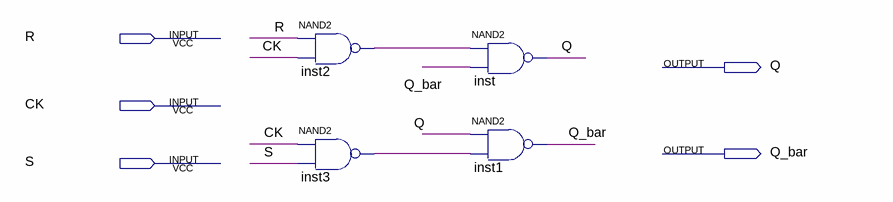
[diagram p0: schematic sheet]
// Quartus schematic RS_FF_NAND.bdf as structural Verilog: 4 symbols, 5 pins
module RS_FF_NAND (
  input  R,
  input  CK,
  input  S,
  output Q,
  output Q_bar
);

  wire inst2_out, inst3_out;

  nand inst2 (inst2_out, R, CK);
  nand inst3 (inst3_out, CK, S);
  nand inst (Q, inst2_out, Q_bar);
  nand inst1 (Q_bar, Q, inst3_out);
endmodule
